# EAGLE design Super-Regenerative-VHF-2Transistor-RickAndersen-October2006 (EAGLE 7.2.0)
A Superregen Receiver for FM broadcast or Aircraft band AM reception http://www.ke3ij.com/superrgn.htm
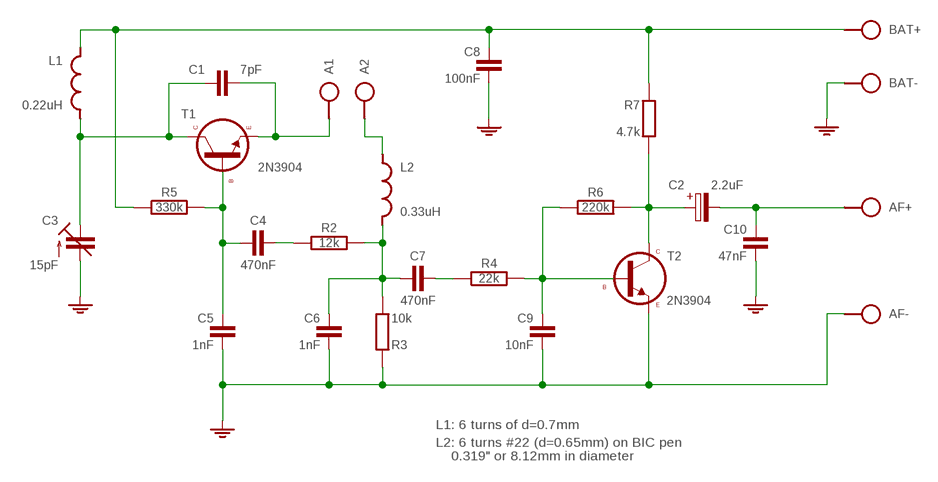
[diagram p0: schematic, sheet 1]

## Parts
A1  SPAD  [SPAD]
A2  SPAD  [SPAD]
AF+  SPAD  [SPAD]
AF-  SPAD  [SPAD]
BAT+  SPAD  [SPAD]
BAT-  SPAD  [SPAD]
C1  7pF  C050-020X036  [C050-020X036]
C2  2.2uF  CPOLE2,5-3  [E2,5-3]
C3  15pF  C-TR-PH201272222-808-2PINB  [TRIM-2222-808]
C4  470nF  C050-024X044/V  [C050-024X044/V]
C5  1nF  C025-020X036  [C025-020X036]
C6  1nF  C025-020X036  [C025-020X036]
C7  470nF  C050-024X044/V  [C050-024X044/V]
C8  100nF  C050-020X044  [C050-020X044]
C9  10nF  C025-015X024  [C025-015X024]
C10  47nF  C050-020X036/V  [C050-020X036/V]
L1  0.22uH  L-SHORT04-5/5V  [L-04-5/6V]
L2  0.33uH  L-SHORTL-08-5/8  [L-08-5/8]
R2  12k  R-H0202/7  [0202/7]
R3  10k  R0202/5-V  [0202/5-V]
R4  22k  R-H0202/7-V  [0202/7-V]
R5  330k  R-H0202/7  [0202/7]
R6  220k  R-H0202/7-V  [0202/7-V]
R7  4.7k  R0202/7-V  [0202/7-V]
T1  2N3904  [TO92]
T2  2N3904  [TO92]

## Nets
GND: AF-.1 BAT-.1 C3.2(A) C5.2 C6.2 C8.2 C9.2 C10.2 R3.1 T2.1(E)
N$1: C1.2 C3.3(E) L1.2 T1.3(C)
N$2: A1.1 C1.1 T1.1(E)
N$3: C7.1 R4.1
N$4: C4.2 C5.1 R5.2 T1.2(B)
N$5: C2.+ R6.2 R7.2 T2.3(C)
N$6: C6.1 C7.2 L2.1 R2.2 R3.2
N$7: C4.1 R2.1
N$8: A2.1 L2.2
N$10: C9.1 R4.2 R6.1 T2.2(B)
N$11: AF+.1 C2.- C10.1
VCC: BAT+.1 C8.1 L1.1 R5.1 R7.1

## Notes on the sheet
- L1: 6 turns of d=0.7mm
- L2: 6 turns #22 (d=0.65mm) on BIC pen
      0.319" or 8.12mm in diameter

## Library data of the parts
A1 A2 AF+ AF- BAT+ BAT- = pad:SPAD
C1 C4-C10 = c:C: CAPACITOR, European symbol
C2 = c:CPOL: POLARIZED CAPACITOR, European symbol
C3 = cap-trim:C-TR-PH20127
L1 L2 = l:L-SHORT
R2 R4-R6 = r:R-H
R3 R7 = r:R: RESISTOR, European symbol
T1 T2 = t:2N3904

## Net classes
0 default: width 0.61 mm

## Board
A Superregen Receiver for FM broadcast or Aircraft band AM reception http://www.ke3ij.com/superrgn.htm
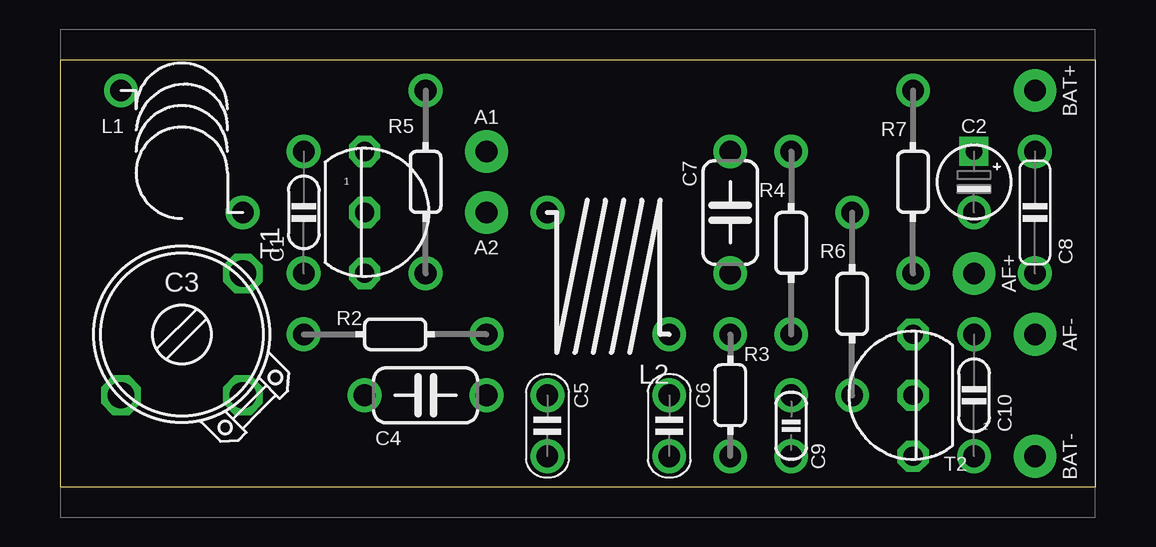
[diagram p1: board, top side]
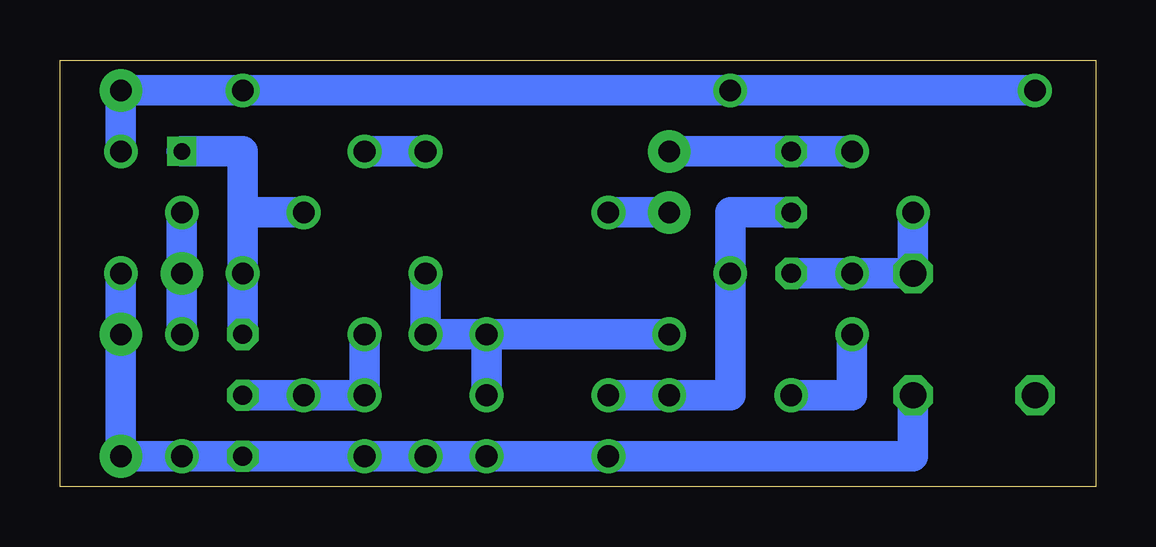
[diagram p2: board, bottom side, seen from below]

Size 43.18 x 17.78 mm. Coordinates in mm from the lower left corner, seen from the top.
Outline: 0,0 43.18,0 43.18,17.78 0,17.78 0,0
Copper layers (1*16): Top 0.035mm / dielectric 1.5mm / Bottom 0.035mm
Design rules "default": minimum track width 10mil, minimum drill 24mil, track to track 8mil, track to pad 8mil, pad to pad 8mil, via to via 8mil, smd to smd 8mil, copper to edge 40mil, drill to drill 8mil, minimum pad ring 10mil, minimum via ring 8mil, stop-mask expansion 4mil, vias tented up to drill 0mil, thermal gap 10mil

### Footprints (pad centres in the part's own frame; a part is rotated, then mirrored left to right if it is on the bottom)
SPAD = drill 0.9 pad 1.778: 1 0,0
C050-020X036 = drill 0.9: 1 -2.54,0; 2 2.54,0
E2,5-3 = drill 0.7 square: + 0,1.27 | drill 0.9: - 0,-1.27
TRIM-2222-808 = drill 1.1 octagon: 1 -2.54,2.54; 2 -2.54,-2.54; 3 2.54,-2.54
C050-024X044/V = drill 0.9: 1 0,2.54; 2 0,-2.54
C025-020X036 = drill 0.9: 1 0,0; 2 2.54,0
C050-020X044 = drill 0.9: 1 -2.54,0; 2 2.54,0
C025-015X024 = drill 0.9: 1 0,1.27; 2 0,-1.27
C050-020X036/V = drill 0.9: 1 0,-2.54; 2 0,2.54
L-04-5/6V = drill 0.9: 1 -2.54,2.54; 2 2.54,-2.54
L-08-5/8 = drill 0.9: 1 -2.54,2.54; 2 2.54,-2.54
0202/7 = drill 0.9: 1 0,3.81; 2 0,-3.81
0202/5-V = drill 0.9: 1 0,2.54; 2 0,-2.54
0202/7-V = drill 0.9: 1 0,3.81; 2 0,-3.81
TO92 = drill 0.8 octagon: 1 0,2.54; 2 0,0; 3 0,-2.54

### Placement (x,y rotation side)
A1  17.78,13.97 270 top
A2  17.78,11.43 90 top
AF+  38.1,8.89 180 top
AF-  40.64,6.35 180 top
BAT+  40.64,16.51 180 top
BAT-  40.64,1.27 180 top
C1  10.16,11.43 270 top
C2  2.2μF  [E2,5-3]  38.1,12.7 0 top
C3  5.08,6.35 90 top
C4  15.24,3.81 90 top
C5  20.32,3.81 270 top
C6  25.4,3.81 270 top
C7  27.94,11.43 0 top
C8  40.64,11.43 270 top
C9  30.48,2.54 0 top
C10  38.1,3.81 180 top
L1  0.22μH  [L-04-5/6V]  5.08,13.97 0 top
L2  0.33μH  [L-08-5/8]  22.86,8.89 180 top
R2  12kΩ  [0202/7]  13.97,6.35 90 top
R3  10kΩ  [0202/5-V]  27.94,3.81 180 top
R4  22kΩ  [0202/7-V]  30.48,10.16 0 top
R5  330kΩ  [0202/7]  15.24,12.7 0 top
R6  220kΩ  [0202/7-V]  33.02,7.62 180 top
R7  4.7kΩ  [0202/7-V]  35.56,12.7 0 top
T1  12.7,11.43 0 top
T2  35.56,3.81 180 top

### Tracks (layer width: path | path; a pad name or v marks a point on that pad's centre or on a via)
GND
  Bottom 1.27: C3.2 7.62,1.27 C5.2 C6.2 R3.1 C9.2 T2.1 C10.2 BAT-.1 AF-.1 C8.2
N$1
  Bottom 1.27: L1.2 C3.3 T1.3 C1.2
N$2
  Bottom 1.27: C1.1 T1.1 A1.1
N$3
  Bottom 1.27: C7.1 R4.1
N$4
  Bottom 1.27: T1.2 15.24,11.43 R5.2 15.24,3.81 C4.2 C5.1
N$5
  Bottom 1.27: 35.56,11.43 R7.2 T2.3 | 35.56,11.43 35.56,13.97 C2.+ | R6.2 35.56,11.43
N$6
  Bottom 1.27: C7.2 R3.2 L2.1 | C6.1 L2.1 | L2.1 R2.2
N$7
  Bottom 1.27: R2.1 10.16,3.81 C4.1
N$8
  Bottom 1.27: A2.1 L2.2
N$10
  Bottom 1.27: T2.2 R6.1 C9.1 R4.2
N$11
  Bottom 1.27: C2.- AF+.1 C10.1
VCC
  Bottom 1.27: L1.1 R5.1 R7.1 BAT+.1 C8.1

### Text on the board
tDocu: 7 | 6 | 5 | 4 | 3 | 2 | 1 | 1 | 2 | 3 | 4 | 5 | 6 | 7 | 8 | 9 | 10 | 11 | 12 | 13 | 14 | 15 | 16